# Altium schematic sheet Myespsch.SchDoc
size A3
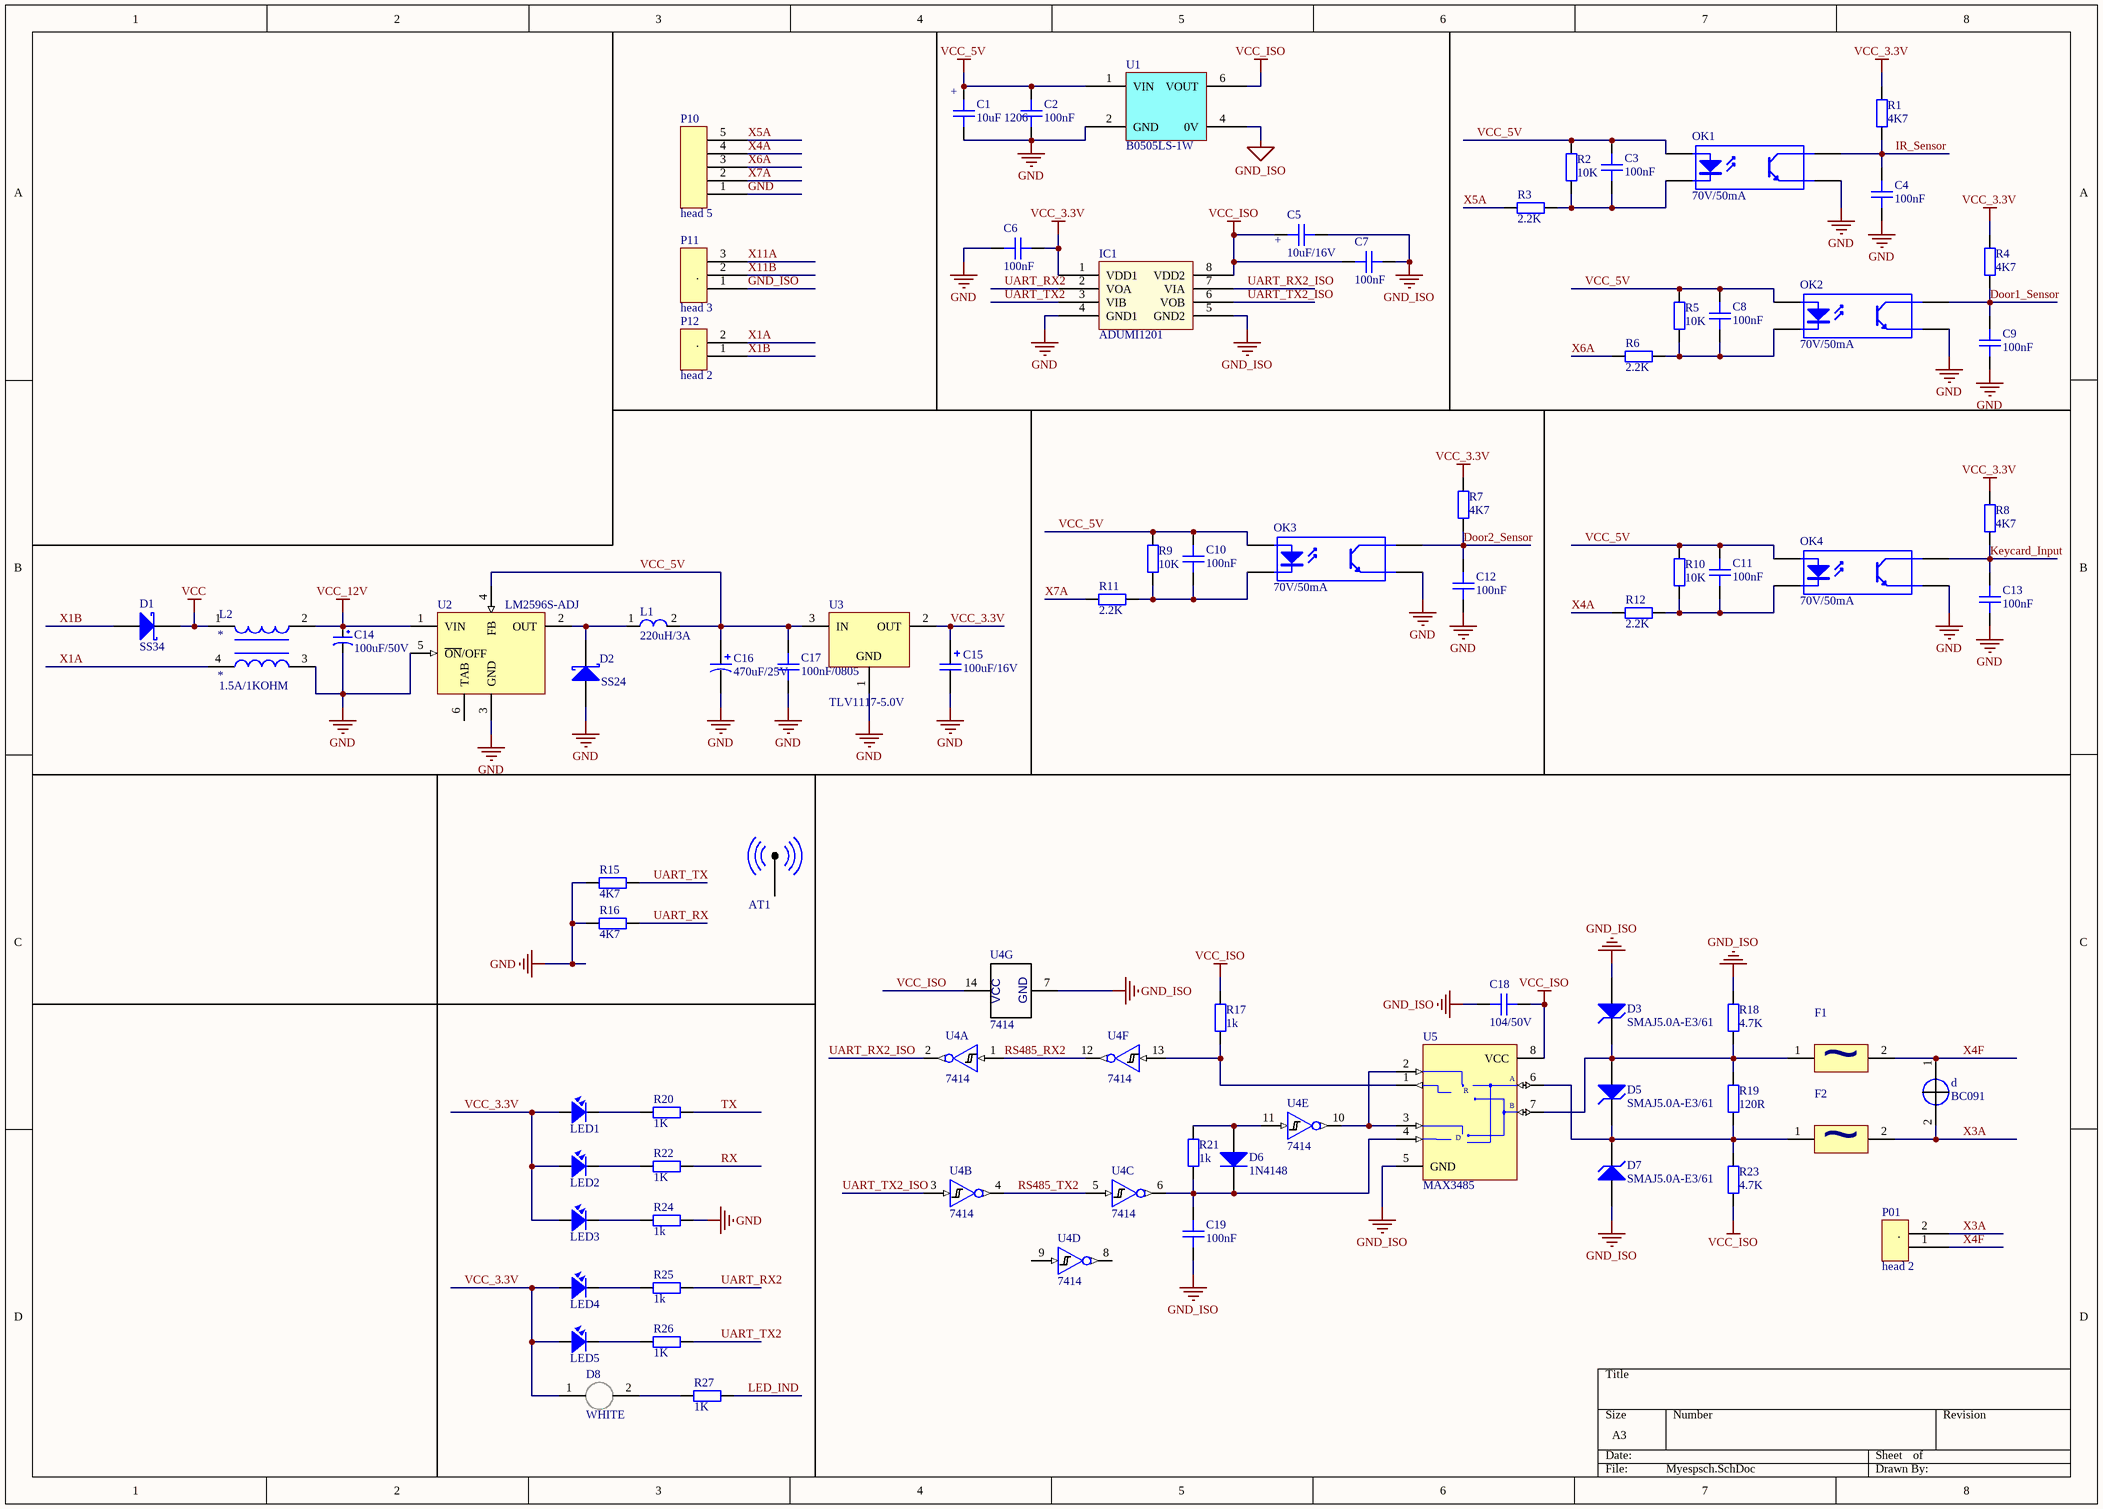
[diagram p0: Myespsch.SchDoc]

## Parts
AT1  AT-GSM-GPS  [ANTENA - SMA2]  (value not drawn)
C1  10uF 1206  [CAPC-1206 (3216)]
C2  100nF  [CAPC-0603 (1608)]
C3  100nF  [CAPC-0603 (1608)]
C4  100nF  [CAPC-0603 (1608)]
C5  10uF/16V  [CAPC-1210 (3225)]
C6  100nF  [CAPC-0603 (1608)]
C7  100nF  [CAPC-0603 (1608)]
C8  100nF  [CAPC-0603 (1608)]
C9  100nF  [CAPC-0603 (1608)]
C10  100nF  [CAPC-0603 (1608)]
C11  100nF  [CAPC-0603 (1608)]
C12  100nF  [CAPC-0603 (1608)]
C13  100nF  [CAPC-0603 (1608)]
C14  100uF/50V  [CP1.5/3.4]
C15  100uF/16V  [CAP_TANTAL_2917(7343-31)]
C16  470uF/25V  [CAP_ALUM_D050_S20_H110]
C17  100nF/0805  [CAPC-0805 (2012)]
C18  104/50V  [CAPC-0603 (1608)]
C19  100nF  [CAPC-0603 (1608)]
d  BC091  [BC091]
D1  SS34  [DIODE_DO214AC_SMA]
D2  SS24  [DIODE_DO214AC_SMA]
D3  SMAJ5.0A-E3/61  [DIODE_DO214AC_SMA]
D5  SMAJ5.0A-E3/61  [DIODE_DO214AC_SMA]
D6  1N4148  [SOD-123]
D7  SMAJ5.0A-E3/61  [DIODE_DO214AC_SMA]
D8  WHITE  [LED_0603_WHITE]
F1  (no value)  [RESC-0805 (2012)]
F2  (no value)  [RESC-0805 (2012)]
IC1  ADUMI1201  [SOIC-8]
L1  220uH/3A  [L-SMD-M-7.3x4.5]
L2  1.5A/1KOHM  [AC LINE]
LED1  LED  [LED-3MM-BLUE]  (value not drawn)
LED2  LED  [LED-3MM-RED]  (value not drawn)
LED3  LED  [LED-3MM-RED]  (value not drawn)
LED4  LED  [LED-3MM-GREEN]  (value not drawn)
LED5  LED  [LED-3MM-YELLOW]  (value not drawn)
OK1  70V/50mA  [OPTO TRANSISTOR_SMD-4]
OK2  70V/50mA  [OPTO TRANSISTOR_SMD-4]
OK3  70V/50mA  [OPTO TRANSISTOR_SMD-4]
OK4  70V/50mA  [OPTO TRANSISTOR_SMD-4]
P01  head 2  [head 2]
P10  head 5  [head 5]
P11  head 3  [head 3]
P12  head 2  [head 2]
R1  4K7  [RESC-0603 (1608)]
R2  10K  [RESC-0603 (1608)]
R3  2.2K  [RESC-1206 (3216)]
R4  4K7  [RESC-0603 (1608)]
R5  10K  [RESC-0603 (1608)]
R6  2.2K  [RESC-1206 (3216)]
R7  4K7  [RESC-0603 (1608)]
R8  4K7  [RESC-0603 (1608)]
R9  10K  [RESC-0603 (1608)]
R10  10K  [RESC-0603 (1608)]
R11  2.2K  [RESC-1206 (3216)]
R12  2.2K  [RESC-1206 (3216)]
R15  4K7  [RESC-0603 (1608)]
R16  4K7  [RESC-0603 (1608)]
R17  1k  [RESC-0603 (1608)]
R18  4.7K  [RESC-0805 (2012)]
R19  120R  [RESC-0805 (2012)]
R20  1K  [RESC-0603 (1608)]
R21  1k  [RESC-0603 (1608)]
R22  1K  [RESC-0603 (1608)]
R23  4.7K  [RESC-0805 (2012)]
R24  1k  [RESC-0603 (1608)]
R25  1k  [RESC-0603 (1608)]
R26  1K  [RESC-0603 (1608)]
R27  1K  [RESC-0603 (1608)]
U1  B0505LS-1W  [B0505LS1WR3]
U2  LM2596S-ADJ  [TO263-5]
U3  TLV1117-5.0V  [SOT-223-4]
U4  7414  [SOIC14]  (parts A,B,C,D,E,F,G of 7)
U5  MAX3485  [SOIC-8]

## Nets
GND: C1.1 C2.1 C4.1 C6.2 C9.1 C12.1 C13.1 C14.2 C15.2 C16.2 C17.2 D2.1(A) IC1.4(GND1) L2.3 OK1.3 OK2.3 OK3.3 OK4.3 P10.1 R15.1 R16.1 R24.2 U1.2(GND) U2.3(GND) U2.5(~{ON}/OFF) U3.1(GND)
GND_ISO: C5.2 C7.1 C18.2 C19.2 D3.1(A) D7.1(A) IC1.5(GND2) P11.1 R18.2 U1.4(0V) U4.7(GND) U5.5(GND)
VCC: D1.2(K) L2.1
VCC_3.3V: C6.1 C15.1 D8.1(A) IC1.1(VDD1) LED1.1 LED2.1 LED3.1 LED4.1 LED5.1 R1.2 R4.2 R7.2 R8.2 U3.2(OUT)
VCC_5V: C1.2 C2.2 C3.2 C8.2 C10.2 C11.2 C16.1 C17.1 L1.2 OK1.1 OK2.1 OK3.1 OK4.1 R2.2 R5.2 R9.2 R10.2 U1.1(VIN) U2.4(FB) U3.3(IN)
VCC_12V: C14.1 L2.2 U2.1(VIN)
VCC_ISO: C5.1 C7.2 C18.1 IC1.8(VDD2) R17.2 R23.1 U1.6(VOUT) U4.14(VCC) U5.8(VCC)
Door1_Sensor: C9.2 OK2.4 R4.1
Door2_Sensor: C12.2 OK3.4 R7.1
IR_Sensor: C4.2 OK1.4 R1.1
Keycard_Input: C13.2 OK4.4 R8.1
LED_IND: R27.2
RS485_RX2: U4.1(A) U4.12(Y)
RS485_TX2: U4.4(Y) U4.5(A)
RX: R22.2
TX: R20.2
UART_RX: R16.2
UART_RX2: IC1.2(VOA) R25.2
UART_RX2_ISO: IC1.7(VIA) U4.2(Y)
UART_TX: R15.2
UART_TX2: IC1.3(VIB) R26.2
UART_TX2_ISO: IC1.6(VOB) U4.3(A)
X1A: L2.4 P12.2(.)
X1B: D1.1(A) P12.1
X3A: d.2 F2.2 P01.2(.)
X4A: P10.4 R12.1
X4F: d.1 F1.2 P01.1
X5A: P10.5 R3.1
X6A: P10.3 R6.1
X7A: P10.2 R11.1
X11A: P11.3
X11B: P11.2(.)
NetC3_1: C3.1 OK1.2 R2.1 R3.2
NetC8_1: C8.1 OK2.2 R5.1 R6.2
NetC10_1: C10.1 OK3.2 R9.1 R11.2
NetC11_1: C11.1 OK4.2 R10.1 R12.2
NetC19_1: C19.1 D6.2(K) R21.1 U4.6(Y) U5.4(DI)
NetD2_2: D2.2(K) L1.1 U2.2(OUT)
NetD3_2: D3.2(K) D5.1(A) F1.1 R18.1 R19.2 U5.7(B)
NetD5_2: D5.2(K) D7.2(K) F2.1 R19.1 R23.2 U5.6(A)
NetD6_1: D6.1(A) R21.2 U4.11(A)
NetD8_2: D8.2(K) R27.1
NetLED1_2: LED1.2 R20.1
NetLED2_2: LED2.2 R22.1
NetLED3_2: LED3.2 R24.1
NetLED4_2: LED4.2 R25.1
NetLED5_2: LED5.2 R26.1
NetR17_1: R17.1 U4.13(A) U5.1(RO)
NetU4_10: U4.10(Y) U5.2(~{RE}) U5.3(DE)

Not connected (* = marked no-connect by the designer): AT1 1(AT) 2; U2 6(TAB); U4 8(Y) 9(A)

## Notes on the sheet
- (near C1) +
- (near C5) +
- (in symbol MAX485CSA) R; D
- (in symbol MF-RX250/72-2) ~

## Library data of the parts
AT1 = RFCON171003SF6B001: CONNECTER ANTENNA GPS GSM; Solder: HAND; CompanyID: VT-00392; MPN: RFCON171003SF6B001; Value: AT-GSM-GPS
C1 = UMK316BBJ106ML-T: CAP CER 10uF 20% 50V X5R 1206; Solder: SMT; Value: 106/50V; CompanyID: VT-01137; MPN: UMK316BBJ106ML-T; Category: CAPACITOR; PinCount: 2
C2-C4 C6-C13 C19 = C0603C104K5RACTU: CompanyID: VT-00982; Solder: SMT; Value: 104/50V; MPN: C0603C104K5RACTU; Category: CAPACITOR; PinCount: 2
C5 = CC1210KKX7R9BB105: CAP CER 1UF 50V X7R 1210; MFR: Yageo; Value: 105/50V; Solder: SMT; MPN: CC1210KKX7R9BB105; Category: CAPACITOR; PinCount: 2
C14 = CP4: Cap 1000uF/16V - 220uF/50V; Description 5: 4,7uF>10uF/250V_3,3uF>10uF/400V - 2,2uF>4,7uF/450V; Description 1: 2200uF-3300uF/6,3V - 1000uF-2200uF/10V; Description 2: 1000uF/16V - 470uF => 1000uF/25V - 100uF/100V; Description 3: 330uF>470uF/35V_220uF>470uF/50V_10uF>22uF/250V; Description 4: 220uF => 330uF/63V - 10uF =>33uF/160 - 200V; Value: 1000uF/16V
C15 = TPSD227K010R0050: CAP TANT 220uF 10V 10% 2917 45mOhm ESR; CompanyID: VT-00021; Solder: SMT; Value: 227/10V; MPN: TPSD227K010R0050; Category: CAPACITOR; PinCount: 2
C16 = 106CKR050M: CAP ALUM 10uF 50V 20% RADIAL; Value: 106/50V; Solder: WAVE; CompanyID: VT-00054; MPN: 106CKR050M; Category: CAPACITOR; PinCount: 2
C17 = CL21B104JBCNNNC: CAP CER 0.1uF 5% 50V X7R 0805; Solder: SMT; Value: 104/50V; CompanyID: VT-00725; MPN: CL21B104JBCNNNC; Category: CAPACITOR; PinCount: 2
C18 = C0603C104K5RACTU: CAP CER 0.1uF 50V 10% X7R 0603; CompanyID: VT-00982; Solder: SMT; MPN: C0603C104K5RACTU; Value: 104/50V; Category: CAPACITOR; PinCount: 2
D1 = SS34: DIODE SCHOTTKY 40V 3A SMA; Solder: SMT; MPN: SS34; Value: SS34; MFR: *
D2 = SS34: DIODE SCHOTTKY 40V 3A SMA; Solder: SMT; Value: SS34; MPN: SS34; MFR: *
D3 D5 D7 = SMAJ5.0A-E3/61: DIODE TVS 5VWM 9.2VC SMA; Solder: SMT; CompanyID: VT-00317; Value: SMAJ5.0A-E3/61; MPN: SMAJ5.0A-E3/61
D6 = 1N4148-W-7: DIODE GEN PURP 100V 300MA SOD123; MPN: 1N4148W-7-F; MFR: Diodes Incorporated; Solder: SMT; Value: 100V/300MA
D8 = LED_WHITE_0603: Value: WHITE
F1 F2 = MF-RX250/72-2: Solder: SMT; CompanyID: VT-xxxx; MPN: MF-RX250/72-2; Value: MF-RX250/72-2
L1 = L-SMD-1: partNo: 78477010; Manufacturer: Wurth Elektronik; Inductance: 1.0 μH; ComponentLink1Description: Manufacturer; ComponentLink1URL: http://www.we-online.de; Created by: Baojun Chen; Created Date: Nov.2015; ComponentLink2Description: Datasheet; ComponentLink2URL: http://katalog.we-online.de/pbs/datasheet/78477010.pdf
L2 = DLW5BSN102SQ2L: IND- CMC 1.5A 2LN 1 KOHM SMD; CompanyID: VT-00918; Solder: SMT; MPN: DLW5BSN102SQ2L; Value: 1.5A/1KOHM; Category: INDUCTOR
LED1-LED5 = LED: LED Single colour Green and Red; Value: LED 3 ly Single Colour
OK1-OK4 = HCPL-817-500E: OPTOISOLATOR 5KV TRANSISTOR 4SMD; Solder: SMT; CompanyID: VT-00147; Value: 70V/50mA; MPN: HCPL-817-500E
R1 R4 R7 R8 R15 R16 = RC0603FR-074K7L: RES SMD 4.7K OHM 1% 1/10W 0603; CompanyID: VT-00327; Solder: SMT; MPN: RC0603FR-074K7L; Value: 4K7; Category: RESISTOR
R2 R5 R9 R10 R20 R22 R24-R27 = RC0603FR-0710KL: RES SMD 10K OHM 1% 1/10W 0603; CompanyID: VT-00328; Solder: SMT; MPN: RC0603FR-0710KL; Value: 10K; Category: RESISTOR
R3 R6 R11 R12 = RC1206JR-070RL: RES SMD 0.0 OHM JUMPER 1/4W 1206; CompanyID: VT-01082; Solder: SMT; Value: 0R; MPN: RC1206JR-070RL; Category: RESISTOR
R17 R21 = RC0603FR-074K7L: RES SMD 4.7K OHM 1% 1/10W 0603; CompanyID: VT-00327; Solder: SMT; Value: 4K7; MPN: RC0603FR-074K7L; Category: RESISTOR
R18 R19 R23 = RC0805FR-0710KL: RES SMD 10K OHM 1% 1/8W 0805; CompanyID: VT-00007; Solder: SMT; Value: 10K; MPN: RC0805FR-0710KL; Category: RESISTOR
U2 = LM2596S-ADJ: SIMPLE SWITCHER Power Converter 150 KHz 3A Step-Down Voltage Regulator; MPN: LM2596SX-ADJ/NOPB; Solder: SMT; Value: LM2596S-ADJ; Category: IC
U3 = TLV1117LV5.0: IC REG LINEAR 5V 800MA SOT223-4; MFR: Texas Instruments; MPN: TLV1117-50CDCYR; Solder: SMT; Value: TLV1117-50; Category: IC
U4 = 7414: IC, M74HC04M, Hex Inverter, SO-14; Text Field1: ST; Text Field2: M74HC04M1R; Text Field3: Mouser; Text Field4: 511-M74HC04M; Text Field6: .22; Text Field5: SO-14; NI?: *; O?: *; Section:: *
U5 = MAX485CSA: Low-Power, Slew-Rate-Limited RS-485/RS-422 Transceiver; MPN: MAX3485ESA; Value: MAX485; Solder: SMT; Category: IC